# Altium schematic sheet lpf_main6.SchDoc: mcHF QRP Transceiver RF board
size A4; Author: K Atanassov; CompanyName: M0NKA; Revision: 0.6.3; SheetTotal: 12
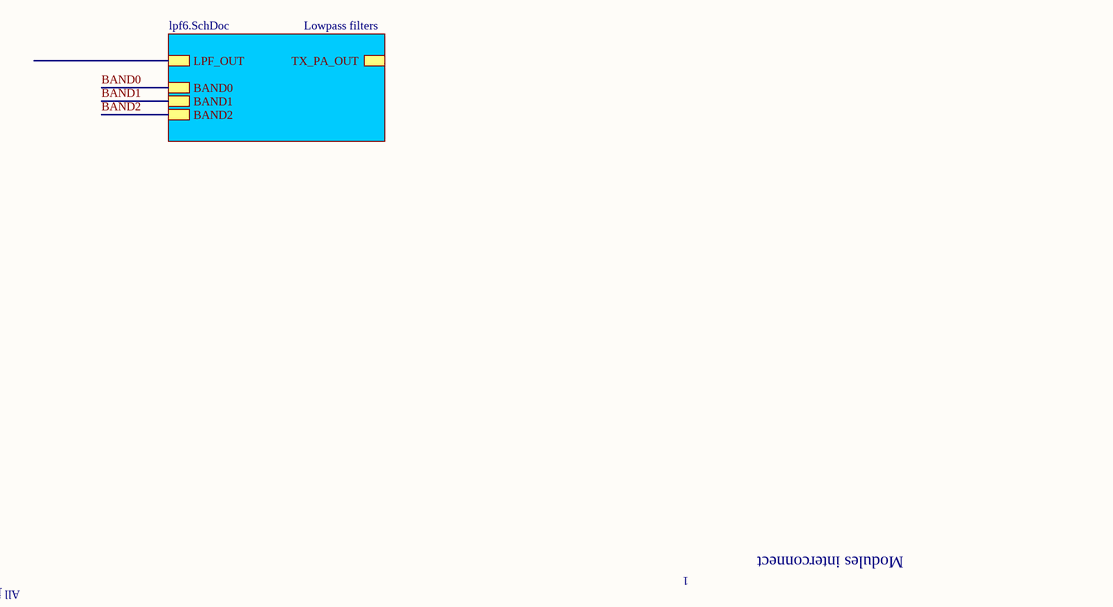
[diagram p0: lpf_main6.SchDoc]

## Sub-sheets
Lowpass filters = lpf6.SchDoc: TX_PA_OUT, LPF_OUT, BAND0, BAND1, BAND2

## Nets
BAND0: sheet Lowpass filters/BAND0
BAND1: sheet Lowpass filters/BAND1
BAND2: sheet Lowpass filters/BAND2

## Notes on the sheet
- All jumpers installed by default, remove selectively to bypass modules during testing
- 1
- Modules interconnect
- Date:
- Revision:
- Sheet
- of
- File: